# Altium schematic sheet 11_ES7201_LOOPBACK.SchDoc: ES7201 Loopback
size B; DocumentNumber: 7; SheetNumber: 7; SheetTotal: 12
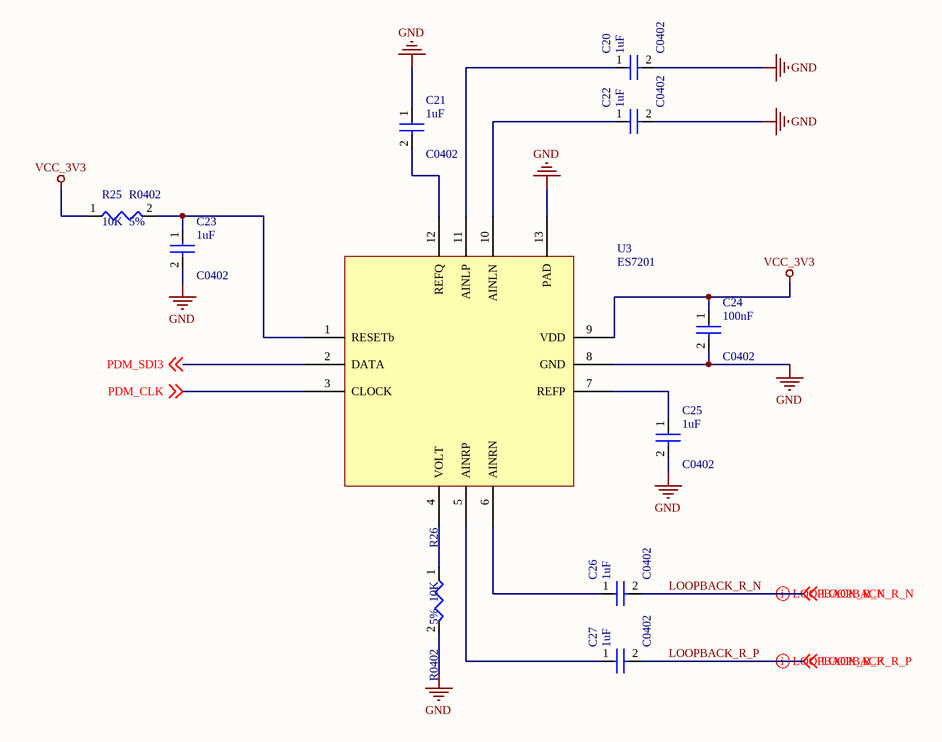
[diagram p0: 11_ES7201_LOOPBACK.SchDoc]

## Parts
C20  1uF  PCB Footprint: C0402  [C0402_L]
C21  1uF  PCB Footprint: C0402  [C0402_L]
C22  1uF  PCB Footprint: C0402  [C0402_L]
C23  1uF  PCB Footprint: C0402  [C0402_L]
C24  100nF  PCB Footprint: C0402  [C0402_L]
C25  1uF  PCB Footprint: C0402  [C0402_L]
C26  1uF  PCB Footprint: C0402  [C0402_L]
C27  1uF  PCB Footprint: C0402  [C0402_L]
R25  10K  Tolerance: 5%  [R0402]
R26  10K  Tolerance: 5%  [R0402]
U3  ES7201  [QFN12]

## Nets
GND: C20.2 C21.1 C22.2 C23.2 C24.2 C25.2 R26.2 U3.8(GND) U3.13(PAD)
VCC_3V3: C24.1 R25.1 U3.9(VDD)
LOOPBACK_R_N: C26.2 ; off-sheet LOOPBACK_R_N
LOOPBACK_R_P: C27.2 ; off-sheet LOOPBACK_R_P
PDM_CLK: U3.3(CLOCK) ; off-sheet PDM_CLK
PDM_SDI3: U3.2(DATA) ; off-sheet PDM_SDI3
NetC20_1: C20.1 U3.11(AINLP)
NetC21_2: C21.2 U3.12(REFQ)
NetC22_1: C22.1 U3.10(AINLN)
NetC23_1: C23.1 R25.2 U3.1(RESETb)
NetC25_1: C25.1 U3.7(REFP)
NetC26_1: C26.1 U3.6(AINRN)
NetC27_1: C27.1 U3.5(AINRP)
NetR26_1: R26.1 U3.4(VOLT)

## Layout directives
differential pair: LOOPBACK_R_N, LOOPBACK_R_P

## Notes on the sheet
- Title
- Size:
- Date:
- B
- Number:
- Time:
- Revision:
- Sheet
- of
- Author: Edward Lai
- Email: edward@vibe.us
- Vibe Inc
- Hangzhou
- vibe.us <http://vibe.us>
- File:

## Library data of the parts
C20-C23 C25-C27 = CAP NP_Dup1: cap,1.00uF,+/-10%,6.3V,X5R,C0402; Priority: A; Part Type: C0402
C24 = CAP NP_Dup1: cap,100.00nF,+/-10%,10V,X5R,C0402; Priority: A; Part Type: C0402
R25 R26 = RESISTOR: 通用厚膜电阻,10K,+/-5%,R0402; Priority: A; PCB Footprint: R0402; Part Type: 通用厚膜电阻
U3 = ES7201: ES7201 PCM to PDM Convertor